# EAGLE design GatewayNode (EAGLE 9.1.0)
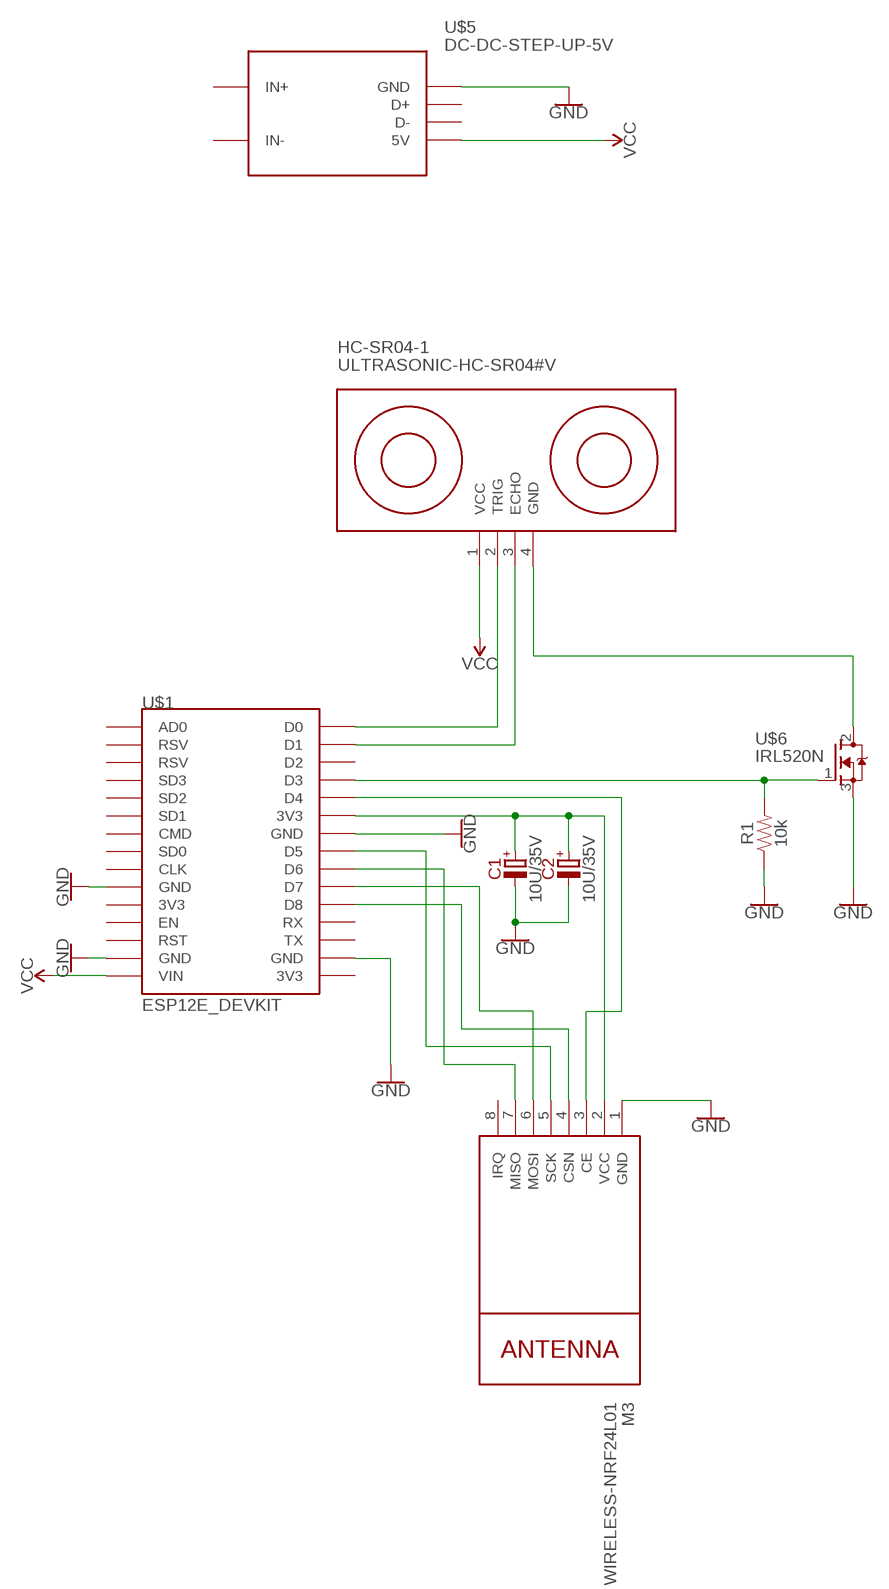
[diagram p0: schematic, sheet 1]

## Parts
C1  10U/35V  [E2-5]
C2  10U/35V  [E2-5]
HC-SR04-1  ULTRASONIC-HC-SR04#V  [ULTRASONIC-HC-SR04#V]
M3  WIRELESS-NRF24L01  [WIRELESS-NRF24L01]
R1  10k  10KOHM-HORIZ_KIT-1/4W-1%  [AXIAL-0.3-KIT]
U$1  ESP12E_DEVKIT  [ESP12E_DEVKIT]
U$5  DC-DC-STEP-UP-5V  [DC-DC-STEP-UP-5V]
U$6  IRL520N  [TO220-VERT]

## Nets
GND: C1.- C2.- M3.1(GND) R1.P$1 U$1.GND@0(GND) U$1.GND@1(GND) U$1.GND@2(GND) U$1.GND@3(GND) U$5.GND U$6.3(S)
N$1: R1.P$2 U$1.D3 U$6.1(G)
N$2: C1.+ C2.+ M3.2(VCC) U$1.3V3@1(3V3)
N$3: M3.3(CE) U$1.D4
N$4: M3.5(SCK) U$1.D5
N$5: M3.7(MISO) U$1.D6
N$6: M3.4(CSN) U$1.D8
N$7: M3.6(MOSI) U$1.D7
N$8: HC-SR04-1.2(TRIG) U$1.D0
N$9: HC-SR04-1.4(GND) U$6.2(D)
N$10: HC-SR04-1.3(ECHO) U$1.D1
VCC: HC-SR04-1.1(VCC) U$1.VIN U$5.5V
Unconnected: M3.8(IRQ) U$1.3V3@0(3V3) U$1.3V3@2(3V3) U$1.AD0 U$1.CLK U$1.CMD U$1.D2 U$1.EN U$1.RST U$1.RSV@0(RSV) U$1.RSV@1(RSV) U$1.RX U$1.SD0 U$1.SD1 U$1.SD2 U$1.SD3 U$1.TX U$5.D+ U$5.D-

## Power pins joined to a net without a drawn wire
IN+: U$5.IN+
IN-: U$5.IN-

## Library data of the parts
C1 C2 = capacitors-electrolytic:?; MOUSER: 647-USW1V100MDD
HC-SR04-1 = diy-modules:ULTRASONIC-HC-SR04: Ultrasonic Ranging Module HC-SR04 More details available here: http://randomnerdtutorials.com/complete-guide-for-ultrasonic-sensor-hc-sr04/ Click here to find device on ebay.com <http://www.ebay.com/sch/hc+sr04+ultrasonic>
M3 = diy-modules:WIRELESS-NRF24L01: 2.4 GHz Wireless Module based on NRF24L01 chip More details available here: http://www.electrodragon.com/w/NRF24L01 Click here to find device on ebay.com <http://www.ebay.com/sch/nrf24l01+arduino>
R1 = SparkFun-Resistors:10KOHM: 10kΩ resistor A resistor is a passive two-terminal electrical component that implements electrical resistance as a circuit element. Resistors act to reduce current flow, and, at the same time, act to lower voltage levels within circuits. - Wikipedia; PROD_ID: RES-12183
U$1 = ESP12E_DEVKIT:ESP12E_DEVKIT: ESP12E DEVKIT BOARD
U$5 = diy-modules:DC-DC-STEP-UP-5V: DC/DC Step-Up Converter
U$6 = IRL520N:IRL520N: IRL520N; AVAILABILITY: Unavailable; DESCRIPTION: 100V Single N-Channel HEXFET Power MOSFET in a TO-220AB package; MF: International Rectifier; MP: IRL520N; PACKAGE: None; PRICE: 1.03 USD

## Net classes
0 default: width 0.305 mm, drill 1 mm

## Board
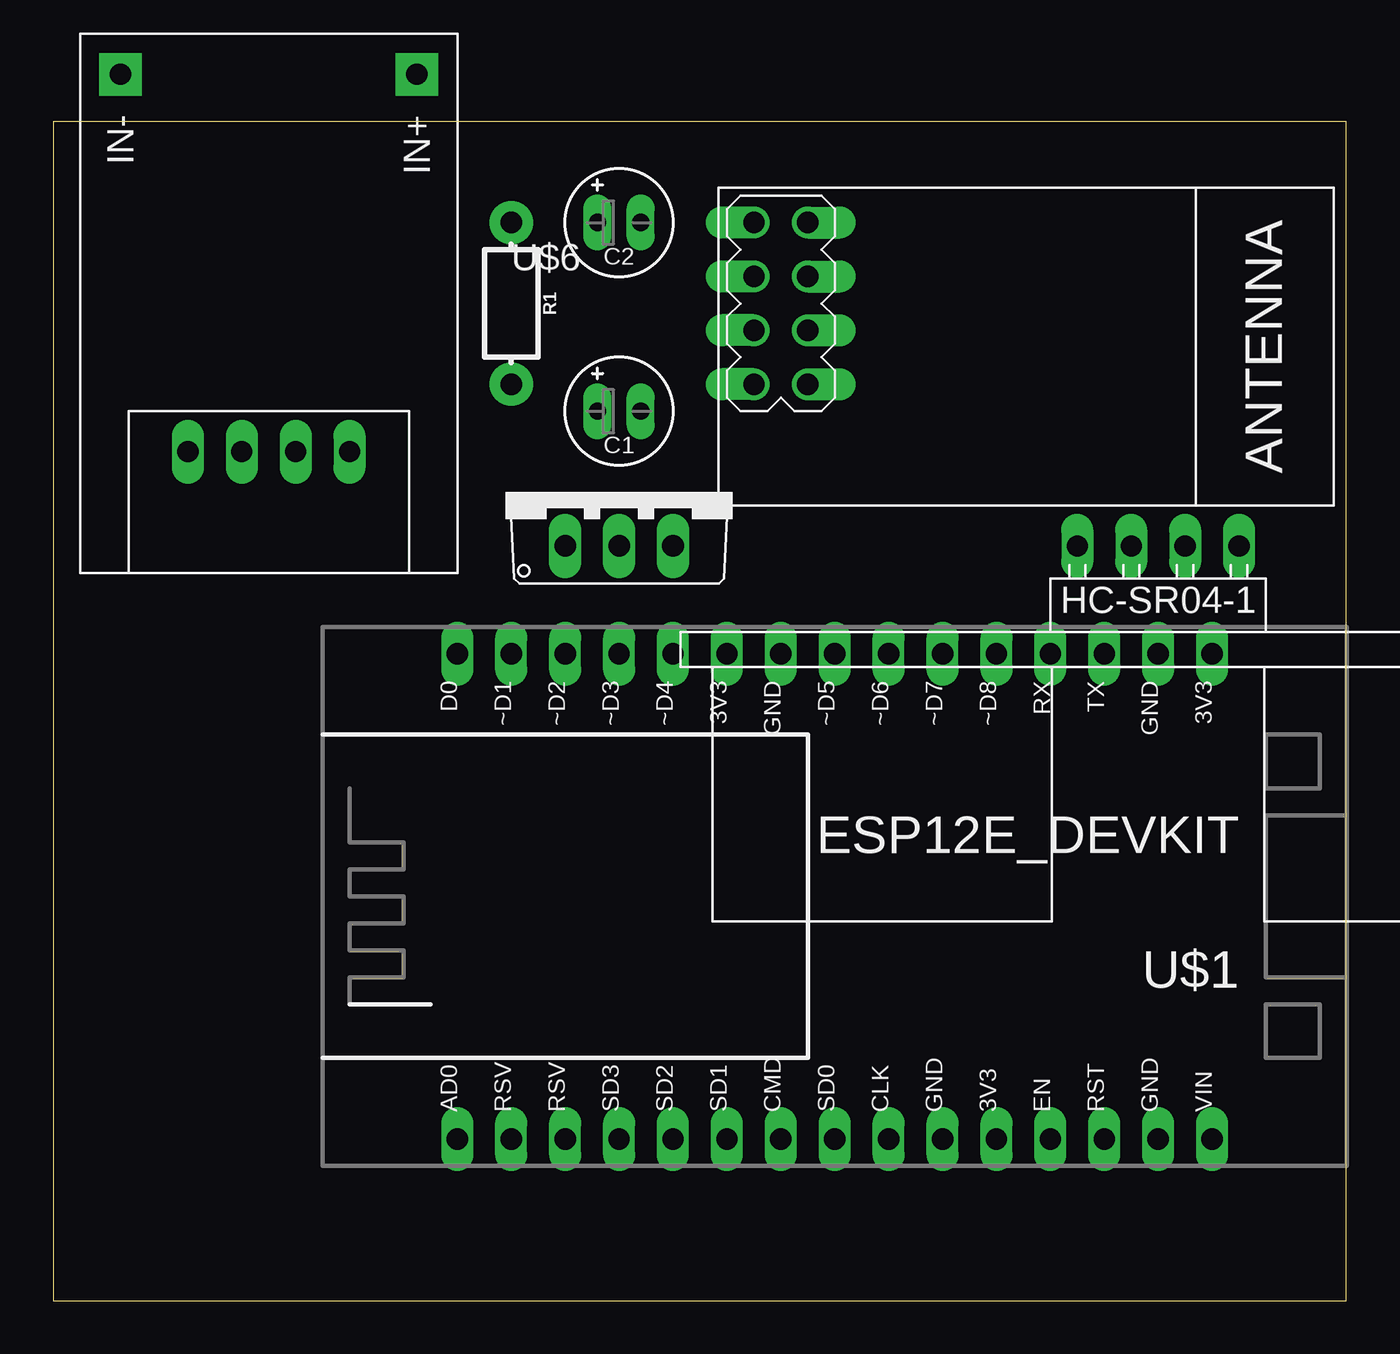
[diagram p1: board, top side]
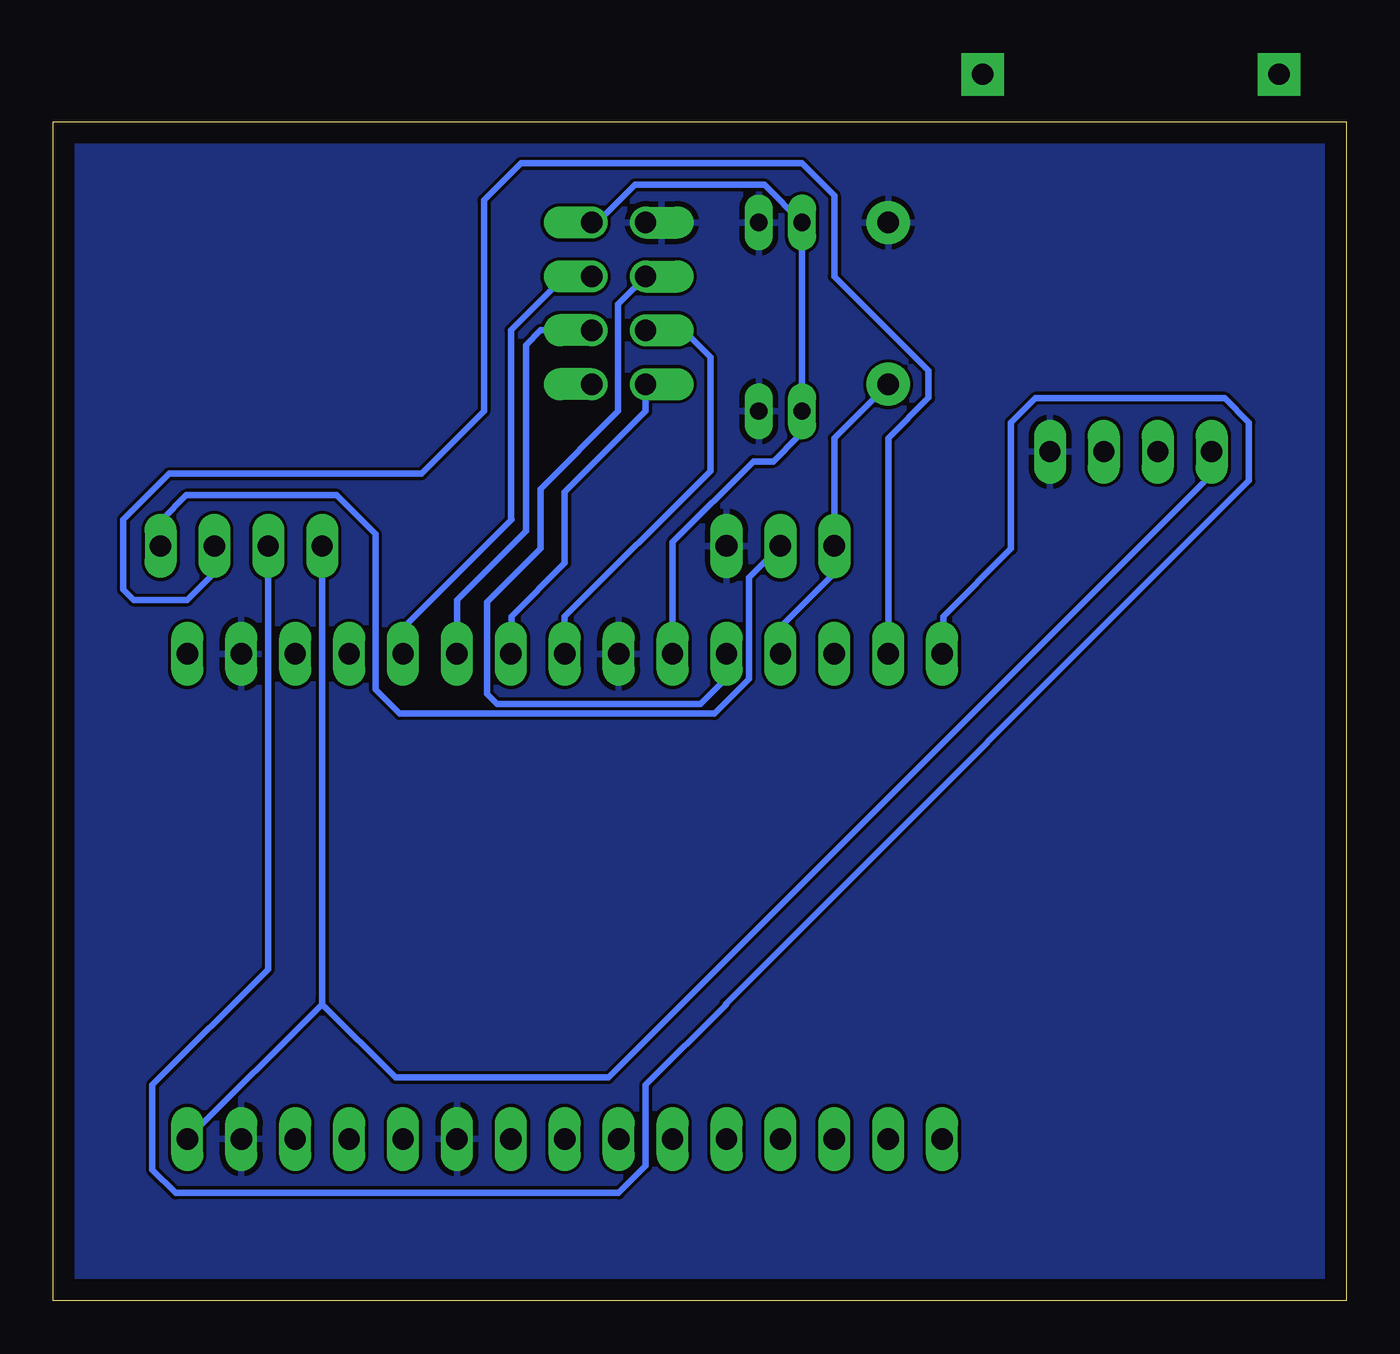
[diagram p2: board, bottom side, seen from below]

Size 60.94 x 55.55 mm. Coordinates in mm from the lower left corner, seen from the top.
Outline: 0,0 60.94,0 60.94,55.55 0,55.55 0,0
Copper layers (1*16): Top 0.035mm / dielectric 1.5mm / Bottom 0.035mm
Design rules "default": minimum track width 6mil, minimum drill 0.35mm, track to track 6mil, track to pad 6mil, pad to pad 6mil, via to via 6mil, smd to smd 6mil, copper to edge 40mil, drill to drill 6mil, minimum pad ring 10mil, minimum via ring 8mil, stop-mask expansion 4mil, vias tented up to drill 0mil, thermal gap 10mil

### Footprints (pad centres in the part's own frame; a part is rotated, then mirrored left to right if it is on the bottom)
E2-5 = drill 0.813 long: + -1.016,0; - 1.016,0
ULTRASONIC-HC-SR04#V = drill 1 long: 1 -3.81,0; 2 -1.27,0; 3 1.27,0; 4 3.81,0
WIRELESS-NRF24L01 = drill 1 offset: 1 -12.7,6.35; 2 -10.16,6.35; 3 -12.7,3.81; 4 -10.16,3.81; 5 -12.7,1.27; 6 -10.16,1.27; 7 -12.7,-1.27; 8 -10.16,-1.27
AXIAL-0.3-KIT = drill 1.016 pad 2.032: P$1 -3.81,0; P$2 3.81,0
ESP12E_DEVKIT = drill 1 long: 3V3@0 -11.43,-7.62; 3V3@1 11.43,5.08; 3V3@2 11.43,-17.78; AD0 -11.43,17.78; CLK -11.43,-2.54; CMD -11.43,2.54; D0 11.43,17.78; D1 11.43,15.24; D2 11.43,12.7; D3 11.43,10.16; D4 11.43,7.62; D5 11.43,0; D6 11.43,-2.54; D7 11.43,-5.08; D8 11.43,-7.62; EN -11.43,-10.16; GND@0 -11.43,-5.08; GND@1 -11.43,-15.24; GND@2 11.43,2.54; GND@3 11.43,-15.24; RST -11.43,-12.7; RSV@0 -11.43,15.24; RSV@1 -11.43,12.7; RX 11.43,-10.16; SD0 -11.43,0; SD1 -11.43,5.08; SD2 -11.43,7.62; SD3 -11.43,10.16; TX 11.43,-12.7; VIN -11.43,-17.78
DC-DC-STEP-UP-5V = drill 1 long: 5V 6.985,-3.81; D+ 6.985,1.27; D- 6.985,-1.27; GND 6.985,3.81 | drill 1 pad 2 square: IN+ -10.795,6.985; IN- -10.795,-6.985
TO220-VERT = drill 1.016 long: 1 -2.54,-2.54; 2 0,-2.54; 3 2.54,-2.54

### Placement (x,y rotation side)
C1  26.67,41.91 0 top
C2  26.67,50.8 0 top
HC-SR04-1  52.07,35.56 0 top
M3  45.72,44.45 0 top
R1  21.59,46.99 270 top
U$1  36.83,19.05 90 top
U$5  10.16,46.99 270 top
U$6  26.67,38.1 0 top

### Tracks (layer width: path | path; a pad name or v marks a point on that pad's centre or on a via)
GND
  pour Bottom: -2.54,60.96 -2.54,-3.81 67.31,-3.81 67.31,60.96
N$1
  Bottom 0.305: U$1.D3 26.67,31.75 24.13,34.29 U$6.1 24.13,40.64 R1.P$2
N$2
  Bottom 0.305: U$1.3V3@1 31.75,35.74 27.94,39.55 27,39.55 25.86,40.69 25.86,41.83 C1.+ C2.+ 27.43,52.58 33.53,52.58 35.31,50.8 M3.2
N$3
  Bottom 0.305: M3.3 34.31,46.97 34.31,41.91 37.97,38.25 37.97,35.43 40.49,32.92 40.49,28.58 40.03,28.12 30.43,28.12 29.21,29.34 U$1.D4
N$4
  Bottom 0.305: U$1.D5 36.83,32.23 29.97,39.09 29.97,44.45 31.24,45.72 M3.5
N$5
  Bottom 0.305: U$1.D6 39.34,30.63 39.34,32.23 36.83,34.75 36.83,38.1 33.02,41.91 M3.7
N$6
  Bottom 0.305: U$1.D8 44.37,30.63 44.37,31.78 39.34,36.81 39.37,36.83 39.37,45.72 36.83,48.26 M3.4
N$7
  Bottom 0.305: U$1.D7 41.91,33.02 38.66,36.27 38.66,45.03 37.97,45.72 M3.6
N$8
  Bottom 0.305: U$1.D0 19,30.63 19,32.23 15.8,35.43 15.8,41.38 14.66,42.52 5.74,42.52 4.6,41.38 4.6,38.63 29.23,14 29.23,13.95 33.02,10.16 33.02,6.35 34.29,5.08 55.17,5.08 56.26,6.17 56.26,10.16 50.8,15.62 HC-SR04-1.2
N$9
  Bottom 0.305: HC-SR04-1.4 55.8,35.66 55.8,36.81 54.66,37.95 47.57,37.95 45.74,36.12 45.74,28.8 44.6,27.66 29.78,27.66 28.15,29.29 28.15,34.08 U$6.2
N$10
  Bottom 0.305: U$1.D1 21.59,40.64 19.68,42.55 19.68,43.81 24.13,48.26 24.13,52.07 25.65,53.59 38.9,53.59 40.64,51.84 40.64,41.91 43.59,38.96 55.47,38.96 57.63,36.81 57.63,33.5 57.15,33.02 54.61,33.02 53.34,34.29 HC-SR04-1.3
VCC
  Bottom 0.305: U$5.5V 6.43,40 6.43,38.86 34.77,10.52 40.64,10.52 44.81,10.52 48.26,13.97 | 54.43,7.77 U$1.VIN 48.26,13.97 | HC-SR04-1.1 48.26,14.33 48.26,13.97

### Text on the board
Document: Wits ParkSmart / 2018 | School of Electrical and Information Engineering